# EAGLE design v7-flex2811 (EAGLE 6.5.0)

## Sheet 1 of 16
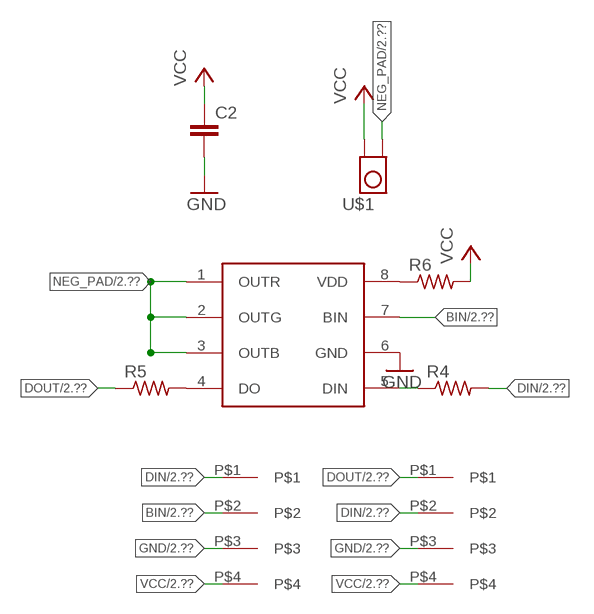
[diagram p0: schematic, sheet 1]

### Parts
C2  C-EUC0201  [C0201]
R4  R-US_R0201  [R0201]
R5  R-US_R0201  [R0201]
R6  R-US_R0201  [R0201]
U$1  TP_4MM_MED_PAD  [TP_4MM_MED_PAD]
U$2  WS2818  [SO08]
U$3  4PAD  [4PAD]
U$4  4PAD  [4PAD]

### Nets
BIN: U$2.7(BIN) U$3.P$2 ; also sheet 2,3,4,5,6,7,8,9,10,11,12,13,14,15,16
DIN: R4.2 U$3.P$1 U$4.P$2 ; also sheet 2,3,4,5,6,7,8,9,10,11,12,13,14,15,16
DOUT: R5.1 U$4.P$1 ; also sheet 2,3,4,5,6,7,8,9,10,11,12,13,14,15,16
GND: C2.2 U$2.6(GND) U$3.P$3 U$4.P$3 ; also sheet 2,3,4,5,6,7,8,9,10,11,12,13,14,15,16
N$4: R4.1 U$2.5(DIN)
N$5: R5.2 U$2.4(DO)
N$6: R6.1 U$2.8(VDD)
NEG_PAD: U$1.P$1 U$2.1(OUTR) U$2.2(OUTG) U$2.3(OUTB) ; also sheet 2,3,4,5,6,7,8,9,10,11,12,13,14,15,16
VCC: C2.1 R6.2 U$1.P$2 U$3.P$4 U$4.P$4 ; also sheet 2,3,4,5,6,7,8,9,10,11,12,13,14,15,16

## Sheet 2 of 16
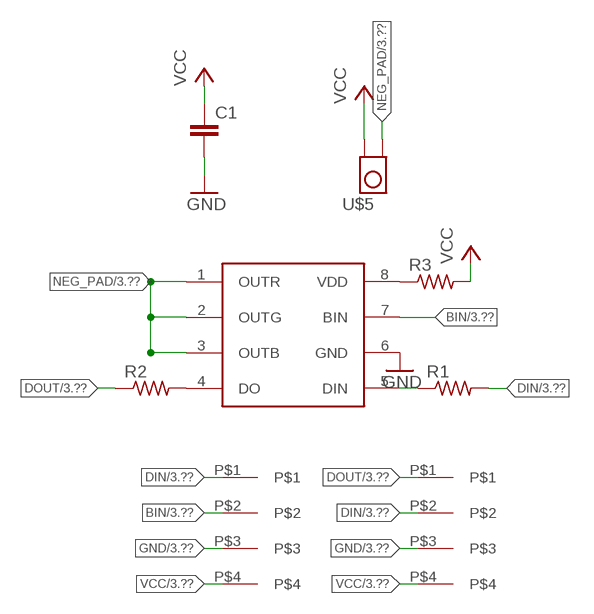
[diagram p1: schematic, sheet 2]

### Parts
C1  C-EUC0201  [C0201]
R1  R-US_R0201  [R0201]
R2  R-US_R0201  [R0201]
R3  R-US_R0201  [R0201]
U$5  TP_4MM_MED_PAD  [TP_4MM_MED_PAD]
U$6  WS2818  [SO08]
U$7  4PAD  [4PAD]
U$8  4PAD  [4PAD]

### Nets
BIN: U$6.7(BIN) U$7.P$2 ; also sheet 1,3,4,5,6,7,8,9,10,11,12,13,14,15,16
DIN: R1.2 U$7.P$1 U$8.P$2 ; also sheet 1,3,4,5,6,7,8,9,10,11,12,13,14,15,16
DOUT: R2.1 U$8.P$1 ; also sheet 1,3,4,5,6,7,8,9,10,11,12,13,14,15,16
GND: C1.2 U$6.6(GND) U$7.P$3 U$8.P$3 ; also sheet 1,3,4,5,6,7,8,9,10,11,12,13,14,15,16
N$1: R1.1 U$6.5(DIN)
N$2: R2.2 U$6.4(DO)
N$3: R3.1 U$6.8(VDD)
NEG_PAD: U$5.P$1 U$6.1(OUTR) U$6.2(OUTG) U$6.3(OUTB) ; also sheet 1,3,4,5,6,7,8,9,10,11,12,13,14,15,16
VCC: C1.1 R3.2 U$5.P$2 U$7.P$4 U$8.P$4 ; also sheet 1,3,4,5,6,7,8,9,10,11,12,13,14,15,16

## Sheet 3 of 16
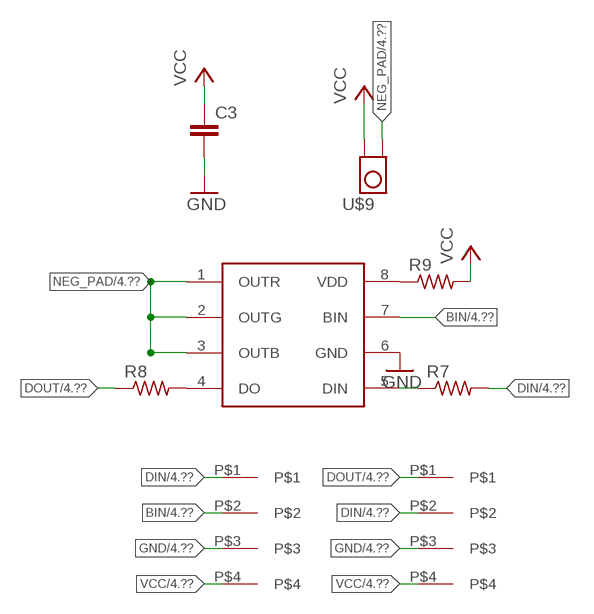
[diagram p2: schematic, sheet 3]

### Parts
C3  C-EUC0201  [C0201]
R7  R-US_R0201  [R0201]
R8  R-US_R0201  [R0201]
R9  R-US_R0201  [R0201]
U$9  TP_4MM_MED_PAD  [TP_4MM_MED_PAD]
U$10  WS2818  [SO08]
U$11  4PAD  [4PAD]
U$12  4PAD  [4PAD]

### Nets
BIN: U$10.7(BIN) U$11.P$2 ; also sheet 1,2,4,5,6,7,8,9,10,11,12,13,14,15,16
DIN: R7.2 U$11.P$1 U$12.P$2 ; also sheet 1,2,4,5,6,7,8,9,10,11,12,13,14,15,16
DOUT: R8.1 U$12.P$1 ; also sheet 1,2,4,5,6,7,8,9,10,11,12,13,14,15,16
GND: C3.2 U$10.6(GND) U$11.P$3 U$12.P$3 ; also sheet 1,2,4,5,6,7,8,9,10,11,12,13,14,15,16
N$7: R7.1 U$10.5(DIN)
N$8: R8.2 U$10.4(DO)
N$9: R9.1 U$10.8(VDD)
NEG_PAD: U$9.P$1 U$10.1(OUTR) U$10.2(OUTG) U$10.3(OUTB) ; also sheet 1,2,4,5,6,7,8,9,10,11,12,13,14,15,16
VCC: C3.1 R9.2 U$9.P$2 U$11.P$4 U$12.P$4 ; also sheet 1,2,4,5,6,7,8,9,10,11,12,13,14,15,16

## Sheet 4 of 16
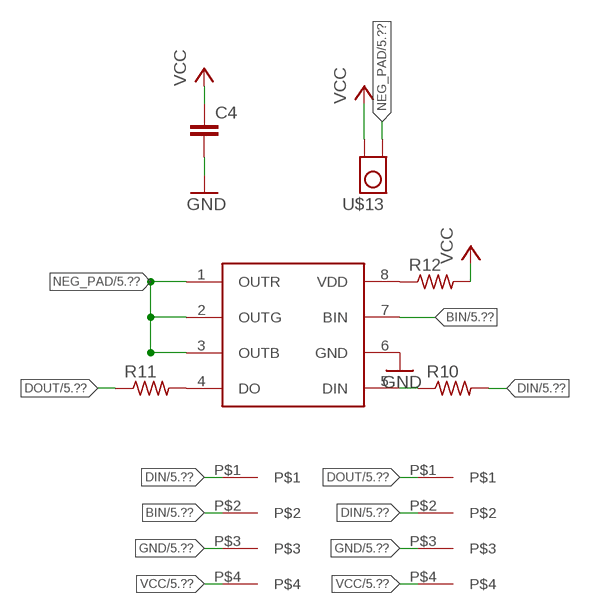
[diagram p3: schematic, sheet 4]

### Parts
C4  C-EUC0201  [C0201]
R10  R-US_R0201  [R0201]
R11  R-US_R0201  [R0201]
R12  R-US_R0201  [R0201]
U$13  TP_4MM_MED_PAD  [TP_4MM_MED_PAD]
U$14  WS2818  [SO08]
U$15  4PAD  [4PAD]
U$16  4PAD  [4PAD]

### Nets
BIN: U$14.7(BIN) U$15.P$2 ; also sheet 1,2,3,5,6,7,8,9,10,11,12,13,14,15,16
DIN: R10.2 U$15.P$1 U$16.P$2 ; also sheet 1,2,3,5,6,7,8,9,10,11,12,13,14,15,16
DOUT: R11.1 U$16.P$1 ; also sheet 1,2,3,5,6,7,8,9,10,11,12,13,14,15,16
GND: C4.2 U$14.6(GND) U$15.P$3 U$16.P$3 ; also sheet 1,2,3,5,6,7,8,9,10,11,12,13,14,15,16
N$10: R10.1 U$14.5(DIN)
N$11: R11.2 U$14.4(DO)
N$12: R12.1 U$14.8(VDD)
NEG_PAD: U$13.P$1 U$14.1(OUTR) U$14.2(OUTG) U$14.3(OUTB) ; also sheet 1,2,3,5,6,7,8,9,10,11,12,13,14,15,16
VCC: C4.1 R12.2 U$13.P$2 U$15.P$4 U$16.P$4 ; also sheet 1,2,3,5,6,7,8,9,10,11,12,13,14,15,16

## Sheet 5 of 16
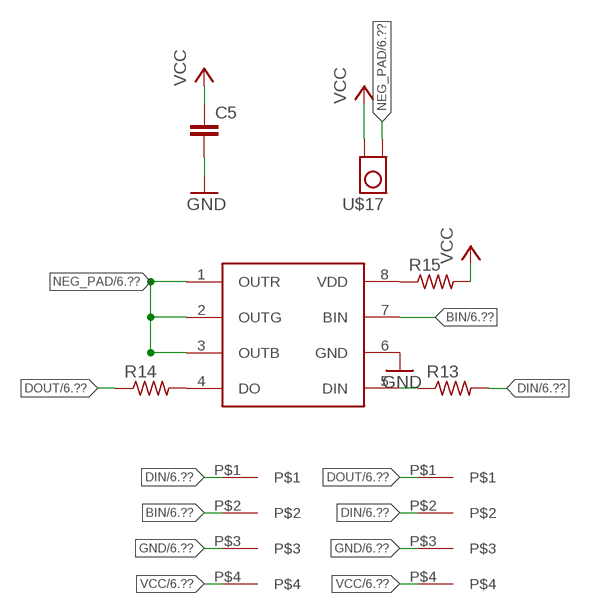
[diagram p4: schematic, sheet 5]

### Parts
C5  C-EUC0201  [C0201]
R13  R-US_R0201  [R0201]
R14  R-US_R0201  [R0201]
R15  R-US_R0201  [R0201]
U$17  TP_4MM_MED_PAD  [TP_4MM_MED_PAD]
U$18  WS2818  [SO08]
U$19  4PAD  [4PAD]
U$20  4PAD  [4PAD]

### Nets
BIN: U$18.7(BIN) U$19.P$2 ; also sheet 1,2,3,4,6,7,8,9,10,11,12,13,14,15,16
DIN: R13.2 U$19.P$1 U$20.P$2 ; also sheet 1,2,3,4,6,7,8,9,10,11,12,13,14,15,16
DOUT: R14.1 U$20.P$1 ; also sheet 1,2,3,4,6,7,8,9,10,11,12,13,14,15,16
GND: C5.2 U$18.6(GND) U$19.P$3 U$20.P$3 ; also sheet 1,2,3,4,6,7,8,9,10,11,12,13,14,15,16
N$13: R13.1 U$18.5(DIN)
N$14: R14.2 U$18.4(DO)
N$15: R15.1 U$18.8(VDD)
NEG_PAD: U$17.P$1 U$18.1(OUTR) U$18.2(OUTG) U$18.3(OUTB) ; also sheet 1,2,3,4,6,7,8,9,10,11,12,13,14,15,16
VCC: C5.1 R15.2 U$17.P$2 U$19.P$4 U$20.P$4 ; also sheet 1,2,3,4,6,7,8,9,10,11,12,13,14,15,16

## Sheet 6 of 16
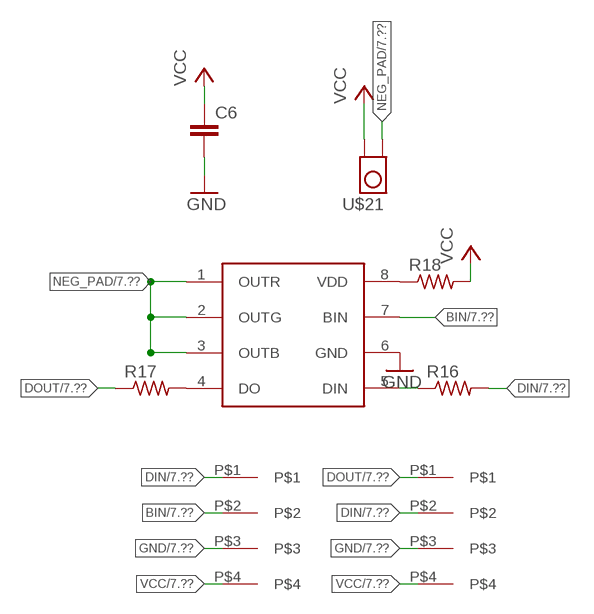
[diagram p5: schematic, sheet 6]

### Parts
C6  C-EUC0201  [C0201]
R16  R-US_R0201  [R0201]
R17  R-US_R0201  [R0201]
R18  R-US_R0201  [R0201]
U$21  TP_4MM_MED_PAD  [TP_4MM_MED_PAD]
U$22  WS2818  [SO08]
U$23  4PAD  [4PAD]
U$24  4PAD  [4PAD]

### Nets
BIN: U$22.7(BIN) U$23.P$2 ; also sheet 1,2,3,4,5,7,8,9,10,11,12,13,14,15,16
DIN: R16.2 U$23.P$1 U$24.P$2 ; also sheet 1,2,3,4,5,7,8,9,10,11,12,13,14,15,16
DOUT: R17.1 U$24.P$1 ; also sheet 1,2,3,4,5,7,8,9,10,11,12,13,14,15,16
GND: C6.2 U$22.6(GND) U$23.P$3 U$24.P$3 ; also sheet 1,2,3,4,5,7,8,9,10,11,12,13,14,15,16
N$16: R16.1 U$22.5(DIN)
N$17: R17.2 U$22.4(DO)
N$18: R18.1 U$22.8(VDD)
NEG_PAD: U$21.P$1 U$22.1(OUTR) U$22.2(OUTG) U$22.3(OUTB) ; also sheet 1,2,3,4,5,7,8,9,10,11,12,13,14,15,16
VCC: C6.1 R18.2 U$21.P$2 U$23.P$4 U$24.P$4 ; also sheet 1,2,3,4,5,7,8,9,10,11,12,13,14,15,16

## Sheet 7 of 16
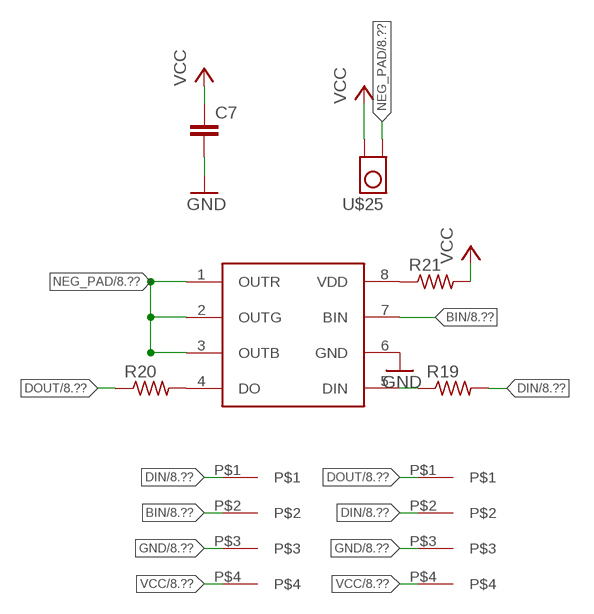
[diagram p6: schematic, sheet 7]

### Parts
C7  C-EUC0201  [C0201]
R19  R-US_R0201  [R0201]
R20  R-US_R0201  [R0201]
R21  R-US_R0201  [R0201]
U$25  TP_4MM_MED_PAD  [TP_4MM_MED_PAD]
U$26  WS2818  [SO08]
U$27  4PAD  [4PAD]
U$28  4PAD  [4PAD]

### Nets
BIN: U$26.7(BIN) U$27.P$2 ; also sheet 1,2,3,4,5,6,8,9,10,11,12,13,14,15,16
DIN: R19.2 U$27.P$1 U$28.P$2 ; also sheet 1,2,3,4,5,6,8,9,10,11,12,13,14,15,16
DOUT: R20.1 U$28.P$1 ; also sheet 1,2,3,4,5,6,8,9,10,11,12,13,14,15,16
GND: C7.2 U$26.6(GND) U$27.P$3 U$28.P$3 ; also sheet 1,2,3,4,5,6,8,9,10,11,12,13,14,15,16
N$19: R19.1 U$26.5(DIN)
N$20: R20.2 U$26.4(DO)
N$21: R21.1 U$26.8(VDD)
NEG_PAD: U$25.P$1 U$26.1(OUTR) U$26.2(OUTG) U$26.3(OUTB) ; also sheet 1,2,3,4,5,6,8,9,10,11,12,13,14,15,16
VCC: C7.1 R21.2 U$25.P$2 U$27.P$4 U$28.P$4 ; also sheet 1,2,3,4,5,6,8,9,10,11,12,13,14,15,16

## Sheet 8 of 16
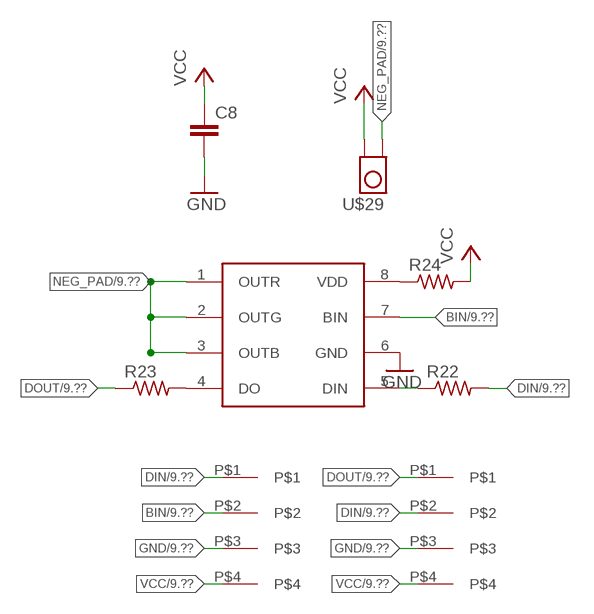
[diagram p7: schematic, sheet 8]

### Parts
C8  C-EUC0201  [C0201]
R22  R-US_R0201  [R0201]
R23  R-US_R0201  [R0201]
R24  R-US_R0201  [R0201]
U$29  TP_4MM_MED_PAD  [TP_4MM_MED_PAD]
U$30  WS2818  [SO08]
U$31  4PAD  [4PAD]
U$32  4PAD  [4PAD]

### Nets
BIN: U$30.7(BIN) U$31.P$2 ; also sheet 1,2,3,4,5,6,7,9,10,11,12,13,14,15,16
DIN: R22.2 U$31.P$1 U$32.P$2 ; also sheet 1,2,3,4,5,6,7,9,10,11,12,13,14,15,16
DOUT: R23.1 U$32.P$1 ; also sheet 1,2,3,4,5,6,7,9,10,11,12,13,14,15,16
GND: C8.2 U$30.6(GND) U$31.P$3 U$32.P$3 ; also sheet 1,2,3,4,5,6,7,9,10,11,12,13,14,15,16
N$22: R22.1 U$30.5(DIN)
N$23: R23.2 U$30.4(DO)
N$24: R24.1 U$30.8(VDD)
NEG_PAD: U$29.P$1 U$30.1(OUTR) U$30.2(OUTG) U$30.3(OUTB) ; also sheet 1,2,3,4,5,6,7,9,10,11,12,13,14,15,16
VCC: C8.1 R24.2 U$29.P$2 U$31.P$4 U$32.P$4 ; also sheet 1,2,3,4,5,6,7,9,10,11,12,13,14,15,16

## Sheet 9 of 16
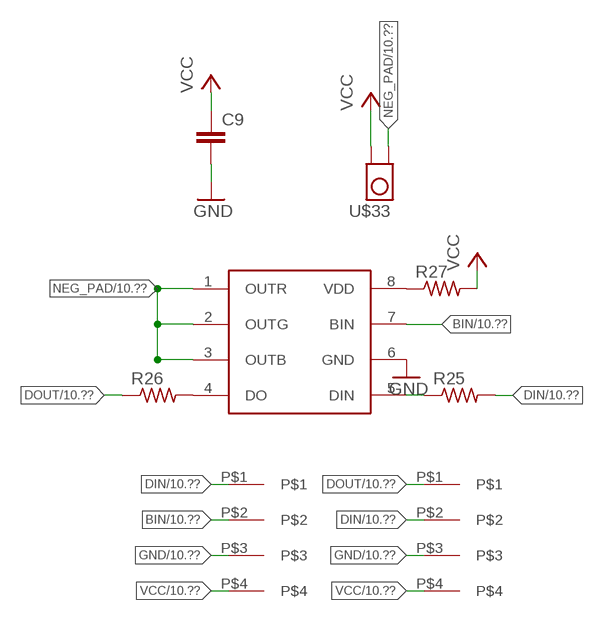
[diagram p8: schematic, sheet 9]

### Parts
C9  C-EUC0201  [C0201]
R25  R-US_R0201  [R0201]
R26  R-US_R0201  [R0201]
R27  R-US_R0201  [R0201]
U$33  TP_4MM_MED_PAD  [TP_4MM_MED_PAD]
U$34  WS2818  [SO08]
U$35  4PAD  [4PAD]
U$36  4PAD  [4PAD]

### Nets
BIN: U$34.7(BIN) U$35.P$2 ; also sheet 1,2,3,4,5,6,7,8,10,11,12,13,14,15,16
DIN: R25.2 U$35.P$1 U$36.P$2 ; also sheet 1,2,3,4,5,6,7,8,10,11,12,13,14,15,16
DOUT: R26.1 U$36.P$1 ; also sheet 1,2,3,4,5,6,7,8,10,11,12,13,14,15,16
GND: C9.2 U$34.6(GND) U$35.P$3 U$36.P$3 ; also sheet 1,2,3,4,5,6,7,8,10,11,12,13,14,15,16
N$25: R25.1 U$34.5(DIN)
N$26: R26.2 U$34.4(DO)
N$27: R27.1 U$34.8(VDD)
NEG_PAD: U$33.P$1 U$34.1(OUTR) U$34.2(OUTG) U$34.3(OUTB) ; also sheet 1,2,3,4,5,6,7,8,10,11,12,13,14,15,16
VCC: C9.1 R27.2 U$33.P$2 U$35.P$4 U$36.P$4 ; also sheet 1,2,3,4,5,6,7,8,10,11,12,13,14,15,16

## Sheet 10 of 16
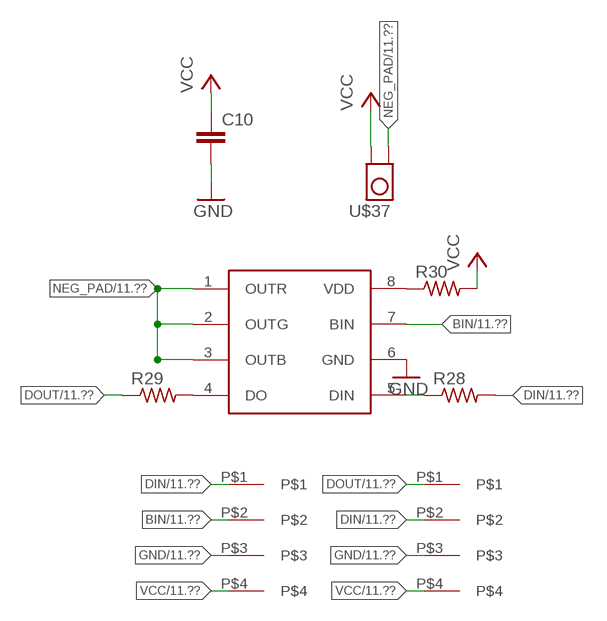
[diagram p9: schematic, sheet 10]

### Parts
C10  C-EUC0201  [C0201]
R28  R-US_R0201  [R0201]
R29  R-US_R0201  [R0201]
R30  R-US_R0201  [R0201]
U$37  TP_4MM_MED_PAD  [TP_4MM_MED_PAD]
U$38  WS2818  [SO08]
U$39  4PAD  [4PAD]
U$40  4PAD  [4PAD]

### Nets
BIN: U$38.7(BIN) U$39.P$2 ; also sheet 1,2,3,4,5,6,7,8,9,11,12,13,14,15,16
DIN: R28.2 U$39.P$1 U$40.P$2 ; also sheet 1,2,3,4,5,6,7,8,9,11,12,13,14,15,16
DOUT: R29.1 U$40.P$1 ; also sheet 1,2,3,4,5,6,7,8,9,11,12,13,14,15,16
GND: C10.2 U$38.6(GND) U$39.P$3 U$40.P$3 ; also sheet 1,2,3,4,5,6,7,8,9,11,12,13,14,15,16
N$28: R28.1 U$38.5(DIN)
N$29: R29.2 U$38.4(DO)
N$30: R30.1 U$38.8(VDD)
NEG_PAD: U$37.P$1 U$38.1(OUTR) U$38.2(OUTG) U$38.3(OUTB) ; also sheet 1,2,3,4,5,6,7,8,9,11,12,13,14,15,16
VCC: C10.1 R30.2 U$37.P$2 U$39.P$4 U$40.P$4 ; also sheet 1,2,3,4,5,6,7,8,9,11,12,13,14,15,16

## Sheet 11 of 16
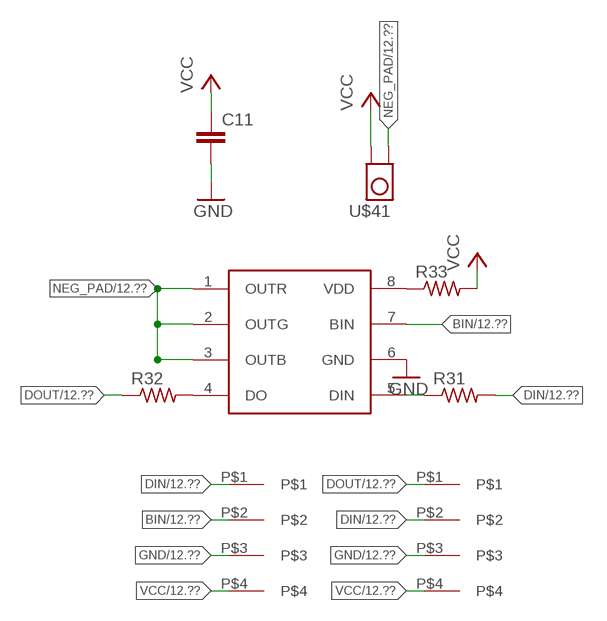
[diagram p10: schematic, sheet 11]

### Parts
C11  C-EUC0201  [C0201]
R31  R-US_R0201  [R0201]
R32  R-US_R0201  [R0201]
R33  R-US_R0201  [R0201]
U$41  TP_4MM_MED_PAD  [TP_4MM_MED_PAD]
U$42  WS2818  [SO08]
U$43  4PAD  [4PAD]
U$44  4PAD  [4PAD]

### Nets
BIN: U$42.7(BIN) U$43.P$2 ; also sheet 1,2,3,4,5,6,7,8,9,10,12,13,14,15,16
DIN: R31.2 U$43.P$1 U$44.P$2 ; also sheet 1,2,3,4,5,6,7,8,9,10,12,13,14,15,16
DOUT: R32.1 U$44.P$1 ; also sheet 1,2,3,4,5,6,7,8,9,10,12,13,14,15,16
GND: C11.2 U$42.6(GND) U$43.P$3 U$44.P$3 ; also sheet 1,2,3,4,5,6,7,8,9,10,12,13,14,15,16
N$31: R31.1 U$42.5(DIN)
N$32: R32.2 U$42.4(DO)
N$33: R33.1 U$42.8(VDD)
NEG_PAD: U$41.P$1 U$42.1(OUTR) U$42.2(OUTG) U$42.3(OUTB) ; also sheet 1,2,3,4,5,6,7,8,9,10,12,13,14,15,16
VCC: C11.1 R33.2 U$41.P$2 U$43.P$4 U$44.P$4 ; also sheet 1,2,3,4,5,6,7,8,9,10,12,13,14,15,16

## Sheet 12 of 16
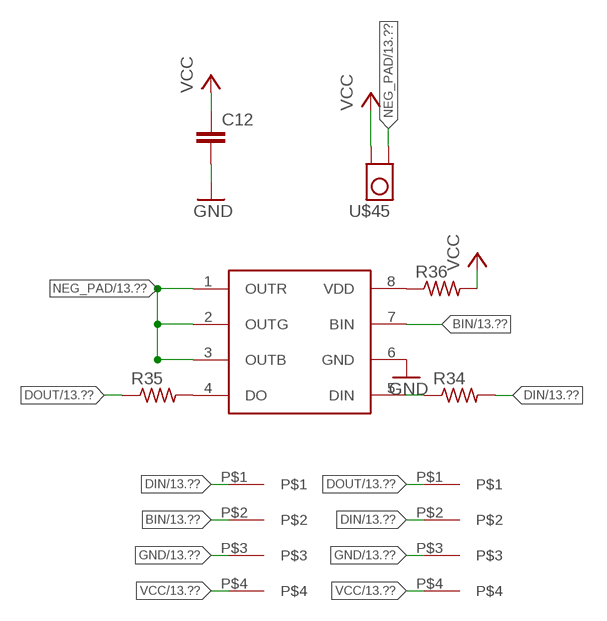
[diagram p11: schematic, sheet 12]

### Parts
C12  C-EUC0201  [C0201]
R34  R-US_R0201  [R0201]
R35  R-US_R0201  [R0201]
R36  R-US_R0201  [R0201]
U$45  TP_4MM_MED_PAD  [TP_4MM_MED_PAD]
U$46  WS2818  [SO08]
U$47  4PAD  [4PAD]
U$48  4PAD  [4PAD]

### Nets
BIN: U$46.7(BIN) U$47.P$2 ; also sheet 1,2,3,4,5,6,7,8,9,10,11,13,14,15,16
DIN: R34.2 U$47.P$1 U$48.P$2 ; also sheet 1,2,3,4,5,6,7,8,9,10,11,13,14,15,16
DOUT: R35.1 U$48.P$1 ; also sheet 1,2,3,4,5,6,7,8,9,10,11,13,14,15,16
GND: C12.2 U$46.6(GND) U$47.P$3 U$48.P$3 ; also sheet 1,2,3,4,5,6,7,8,9,10,11,13,14,15,16
N$34: R34.1 U$46.5(DIN)
N$35: R35.2 U$46.4(DO)
N$36: R36.1 U$46.8(VDD)
NEG_PAD: U$45.P$1 U$46.1(OUTR) U$46.2(OUTG) U$46.3(OUTB) ; also sheet 1,2,3,4,5,6,7,8,9,10,11,13,14,15,16
VCC: C12.1 R36.2 U$45.P$2 U$47.P$4 U$48.P$4 ; also sheet 1,2,3,4,5,6,7,8,9,10,11,13,14,15,16

## Sheet 13 of 16
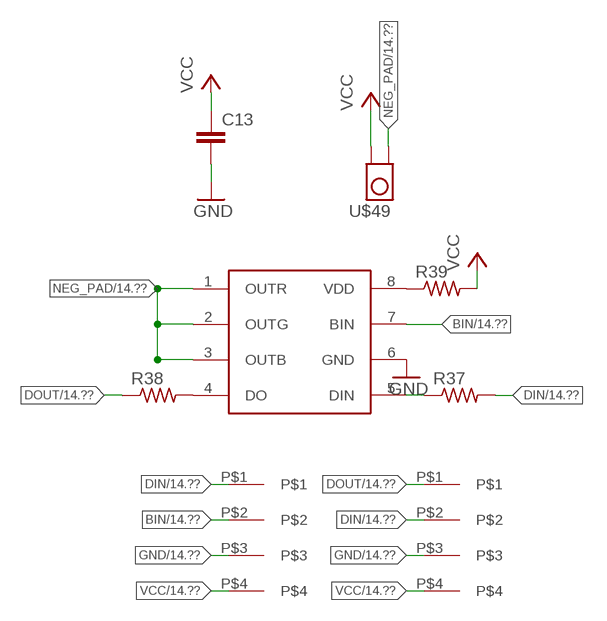
[diagram p12: schematic, sheet 13]

### Parts
C13  C-EUC0201  [C0201]
R37  R-US_R0201  [R0201]
R38  R-US_R0201  [R0201]
R39  R-US_R0201  [R0201]
U$49  TP_4MM_MED_PAD  [TP_4MM_MED_PAD]
U$50  WS2818  [SO08]
U$51  4PAD  [4PAD]
U$52  4PAD  [4PAD]

### Nets
BIN: U$50.7(BIN) U$51.P$2 ; also sheet 1,2,3,4,5,6,7,8,9,10,11,12,14,15,16
DIN: R37.2 U$51.P$1 U$52.P$2 ; also sheet 1,2,3,4,5,6,7,8,9,10,11,12,14,15,16
DOUT: R38.1 U$52.P$1 ; also sheet 1,2,3,4,5,6,7,8,9,10,11,12,14,15,16
GND: C13.2 U$50.6(GND) U$51.P$3 U$52.P$3 ; also sheet 1,2,3,4,5,6,7,8,9,10,11,12,14,15,16
N$37: R37.1 U$50.5(DIN)
N$38: R38.2 U$50.4(DO)
N$39: R39.1 U$50.8(VDD)
NEG_PAD: U$49.P$1 U$50.1(OUTR) U$50.2(OUTG) U$50.3(OUTB) ; also sheet 1,2,3,4,5,6,7,8,9,10,11,12,14,15,16
VCC: C13.1 R39.2 U$49.P$2 U$51.P$4 U$52.P$4 ; also sheet 1,2,3,4,5,6,7,8,9,10,11,12,14,15,16

## Sheet 14 of 16
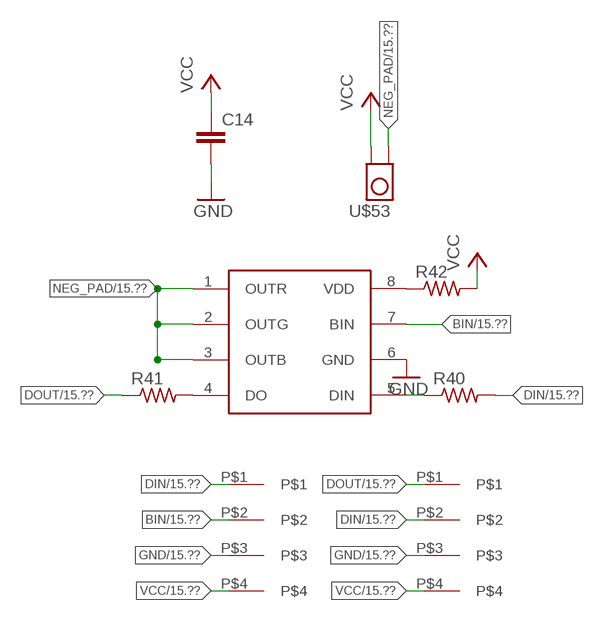
[diagram p13: schematic, sheet 14]

### Parts
C14  C-EUC0201  [C0201]
R40  R-US_R0201  [R0201]
R41  R-US_R0201  [R0201]
R42  R-US_R0201  [R0201]
U$53  TP_4MM_MED_PAD  [TP_4MM_MED_PAD]
U$54  WS2818  [SO08]
U$55  4PAD  [4PAD]
U$56  4PAD  [4PAD]

### Nets
BIN: U$54.7(BIN) U$55.P$2 ; also sheet 1,2,3,4,5,6,7,8,9,10,11,12,13,15,16
DIN: R40.2 U$55.P$1 U$56.P$2 ; also sheet 1,2,3,4,5,6,7,8,9,10,11,12,13,15,16
DOUT: R41.1 U$56.P$1 ; also sheet 1,2,3,4,5,6,7,8,9,10,11,12,13,15,16
GND: C14.2 U$54.6(GND) U$55.P$3 U$56.P$3 ; also sheet 1,2,3,4,5,6,7,8,9,10,11,12,13,15,16
N$40: R40.1 U$54.5(DIN)
N$41: R41.2 U$54.4(DO)
N$42: R42.1 U$54.8(VDD)
NEG_PAD: U$53.P$1 U$54.1(OUTR) U$54.2(OUTG) U$54.3(OUTB) ; also sheet 1,2,3,4,5,6,7,8,9,10,11,12,13,15,16
VCC: C14.1 R42.2 U$53.P$2 U$55.P$4 U$56.P$4 ; also sheet 1,2,3,4,5,6,7,8,9,10,11,12,13,15,16

## Sheet 15 of 16
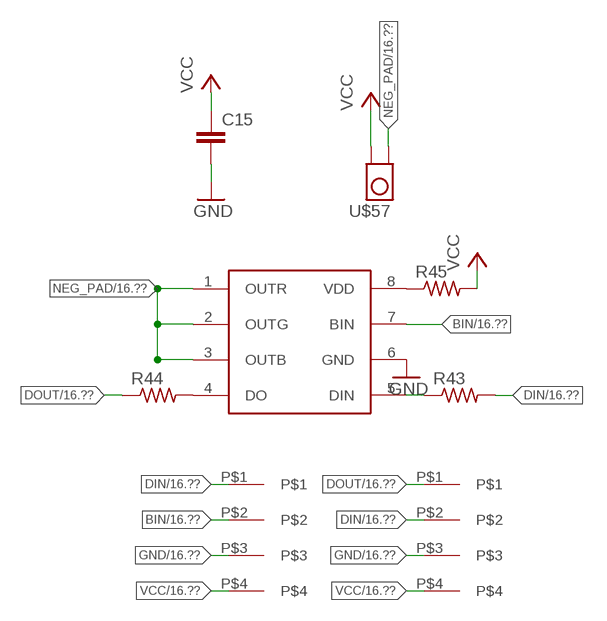
[diagram p14: schematic, sheet 15]

### Parts
C15  C-EUC0201  [C0201]
R43  R-US_R0201  [R0201]
R44  R-US_R0201  [R0201]
R45  R-US_R0201  [R0201]
U$57  TP_4MM_MED_PAD  [TP_4MM_MED_PAD]
U$58  WS2818  [SO08]
U$59  4PAD  [4PAD]
U$60  4PAD  [4PAD]

### Nets
BIN: U$58.7(BIN) U$59.P$2 ; also sheet 1,2,3,4,5,6,7,8,9,10,11,12,13,14,16
DIN: R43.2 U$59.P$1 U$60.P$2 ; also sheet 1,2,3,4,5,6,7,8,9,10,11,12,13,14,16
DOUT: R44.1 U$60.P$1 ; also sheet 1,2,3,4,5,6,7,8,9,10,11,12,13,14,16
GND: C15.2 U$58.6(GND) U$59.P$3 U$60.P$3 ; also sheet 1,2,3,4,5,6,7,8,9,10,11,12,13,14,16
N$43: R43.1 U$58.5(DIN)
N$44: R44.2 U$58.4(DO)
N$45: R45.1 U$58.8(VDD)
NEG_PAD: U$57.P$1 U$58.1(OUTR) U$58.2(OUTG) U$58.3(OUTB) ; also sheet 1,2,3,4,5,6,7,8,9,10,11,12,13,14,16
VCC: C15.1 R45.2 U$57.P$2 U$59.P$4 U$60.P$4 ; also sheet 1,2,3,4,5,6,7,8,9,10,11,12,13,14,16

## Sheet 16 of 16
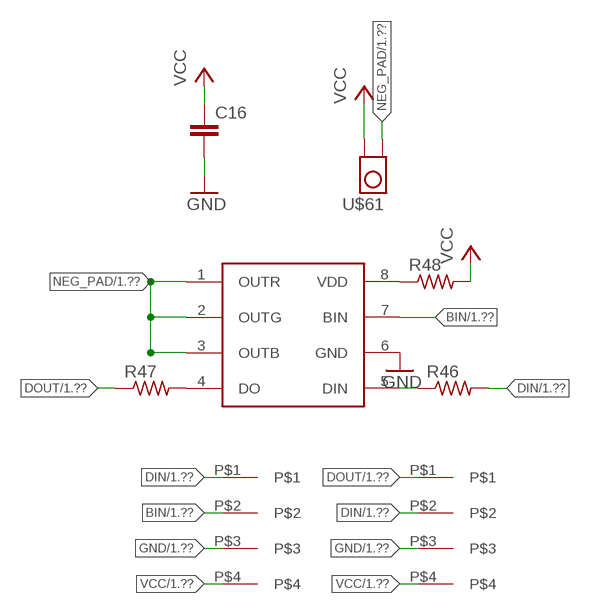
[diagram p15: schematic, sheet 16]

### Parts
C16  C-EUC0201  [C0201]
R46  R-US_R0201  [R0201]
R47  R-US_R0201  [R0201]
R48  R-US_R0201  [R0201]
U$61  TP_4MM_MED_PAD  [TP_4MM_MED_PAD]
U$62  WS2818  [SO08]
U$63  4PAD  [4PAD]
U$64  4PAD  [4PAD]

### Nets
BIN: U$62.7(BIN) U$63.P$2 ; also sheet 1,2,3,4,5,6,7,8,9,10,11,12,13,14,15
DIN: R46.2 U$63.P$1 U$64.P$2 ; also sheet 1,2,3,4,5,6,7,8,9,10,11,12,13,14,15
DOUT: R47.1 U$64.P$1 ; also sheet 1,2,3,4,5,6,7,8,9,10,11,12,13,14,15
GND: C16.2 U$62.6(GND) U$63.P$3 U$64.P$3 ; also sheet 1,2,3,4,5,6,7,8,9,10,11,12,13,14,15
N$46: R46.1 U$62.5(DIN)
N$47: R47.2 U$62.4(DO)
N$48: R48.1 U$62.8(VDD)
NEG_PAD: U$61.P$1 U$62.1(OUTR) U$62.2(OUTG) U$62.3(OUTB) ; also sheet 1,2,3,4,5,6,7,8,9,10,11,12,13,14,15
VCC: C16.1 R48.2 U$61.P$2 U$63.P$4 U$64.P$4 ; also sheet 1,2,3,4,5,6,7,8,9,10,11,12,13,14,15

## Library data of the parts
C1-C16 = rcl:C-EU: CAPACITOR, European symbol
R1-R48 = rcl:R-US_: RESISTOR, American symbol
U$1 U$5 U$9 U$13 U$17 U$21 U$25 U$29 U$33 U$37 U$41 U$45 U$49 U$53 U$57 U$61 = tom-tappytap-v5-flex:TP_4MM_MED_PAD
U$2 U$6 U$10 U$14 U$18 U$22 U$26 U$30 U$34 U$38 U$42 U$46 U$50 U$54 U$58 U$62 = adafruit:WS2818
U$3 U$4 U$7 U$8 U$11 U$12 U$15 U$16 U$19 U$20 U$23 U$24 U$27 U$28 U$31 U$32 U$35 U$36 U$39 U$40 U$43 U$44 U$47 U$48 U$51 U$52 U$55 U$56 U$59 U$60 U$63 U$64 = Sparky:4PAD

## Board
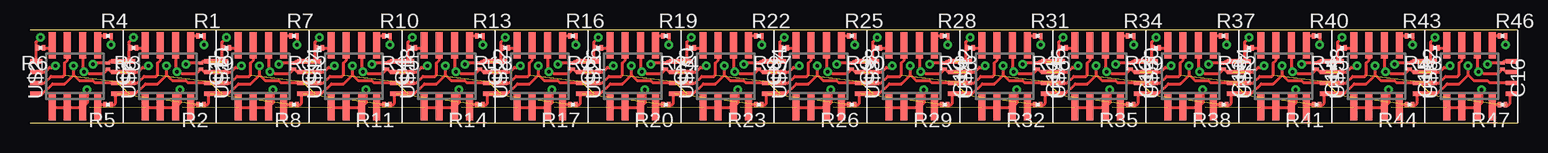
[diagram p16: board, top side]
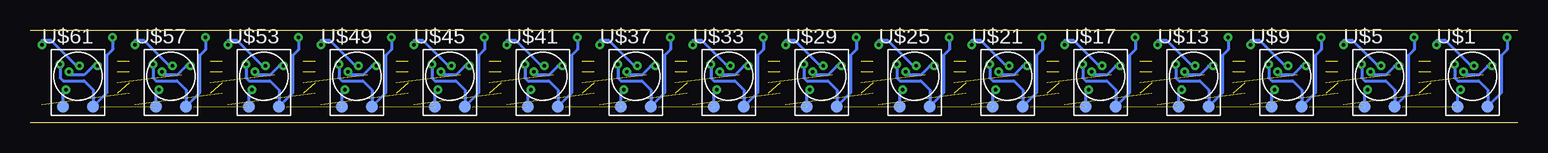
[diagram p17: board, bottom side, seen from below]

Size 124 x 7.75 mm. Coordinates in mm from the lower left corner, seen from the top.
Outline: 0,0 7.75,0 15.5,0 23.25,0 31,0 38.75,0 46.5,0 54.25,0 62,0 69.75,0 77.5,0 85.25,0 93,0 100.75,0 108.5,0 116.25,0 124,0
Outline: 0,7.75 7.75,7.75 15.5,7.75 23.25,7.75 31,7.75 38.75,7.75 46.5,7.75 54.25,7.75 62,7.75 69.75,7.75 77.5,7.75 85.25,7.75 93,7.75 100.75,7.75 108.5,7.75 116.25,7.75 124,7.75
Copper layers (1*16): Top 0.035mm / dielectric 1.5mm / Bottom 0.035mm
Design rules "default *": minimum track width 6mil, minimum drill 3mil, track to track 8mil, track to pad 8mil, pad to pad 8mil, via to via 8mil, smd to smd 8mil, copper to edge 40mil, drill to drill 8mil, minimum pad ring 10mil, minimum via ring 8mil, stop-mask expansion 4mil, vias tented up to drill 0mil, thermal gap 10mil

### Footprints (pad centres in the part's own frame; a part is rotated, then mirrored left to right if it is on the bottom)
C0201 = smd 0.25 x 0.35: 1 -0.25,0; 2 0.25,0
R0201 = smd 0.28 x 0.43: 1 -0.255,0; 2 0.255,0
TP_4MM_MED_PAD = smd 1.016 x 1.016: P$1 -1.24,-2.55; P$2 1.24,-2.55
SO08 = smd 0.6 x 2.2: 1 -1.905,-2.6; 2 -0.635,-2.6; 3 0.635,-2.6; 4 1.905,-2.6; 5 1.905,2.6; 6 0.635,2.6; 7 -0.635,2.6; 8 -1.905,2.6
4PAD = smd 1 x 0.4: P$1 0,0.3 | smd 1 x 0.35: P$2 0,1.2; P$3 0,2.1; P$4 0,3

### Placement (x,y rotation side)
C1  14.25,4.75 270 top
C2  6.5,4.75 270 top
C3  22,4.75 270 top
C4  29.75,4.75 270 top
C5  37.5,4.75 270 top
C6  45.25,4.75 270 top
C7  53,4.75 270 top
C8  60.75,4.75 270 top
C9  68.5,4.75 270 top
C10  76.25,4.75 270 top
C11  84,4.75 270 top
C12  91.75,4.75 270 top
C13  99.5,4.75 270 top
C14  107.25,4.75 270 top
C15  115,4.75 270 top
C16  122.75,4.75 270 top
R1  14.25,7.25 0 top
R2  14.25,1.5 180 top
R3  8.62,6.25 180 top
R4  6.5,7.25 0 top
R5  6.5,1.5 180 top
R6  0.88,6.25 180 top
R7  22,7.25 0 top
R8  22,1.5 180 top
R9  16.38,6.25 180 top
R10  29.75,7.25 0 top
R11  29.75,1.5 180 top
R12  24.12,6.25 180 top
R13  37.5,7.25 0 top
R14  37.5,1.5 180 top
R15  31.88,6.25 180 top
R16  45.25,7.25 0 top
R17  45.25,1.5 180 top
R18  39.62,6.25 180 top
R19  53,7.25 0 top
R20  53,1.5 180 top
R21  47.38,6.25 180 top
R22  60.75,7.25 0 top
R23  60.75,1.5 180 top
R24  55.12,6.25 180 top
R25  68.5,7.25 0 top
R26  68.5,1.5 180 top
R27  62.88,6.25 180 top
R28  76.25,7.25 0 top
R29  76.25,1.5 180 top
R30  70.62,6.25 180 top
R31  84,7.25 0 top
R32  84,1.5 180 top
R33  78.38,6.25 180 top
R34  91.75,7.25 0 top
R35  91.75,1.5 180 top
R36  86.12,6.25 180 top
R37  99.5,7.25 0 top
R38  99.5,1.5 180 top
R39  93.88,6.25 180 top
R40  107.25,7.25 0 top
R41  107.25,1.5 180 top
R42  101.62,6.25 180 top
R43  115,7.25 0 top
R44  115,1.5 180 top
R45  109.38,6.25 180 top
R46  122.75,7.25 0 top
R47  122.75,1.5 180 top
R48  117.12,6.25 180 top
U$1  3.75,3.88 0 bottom
U$2  3.75,3.88 0 top
U$3  0.5,2.12 0 top
U$4  7.25,2.12 0 top
U$5  11.5,3.88 0 bottom
U$6  11.5,3.88 0 top
U$7  8.25,2.12 0 top
U$8  15,2.12 0 top
U$9  19.25,3.88 0 bottom
U$10  19.25,3.88 0 top
U$11  16,2.12 0 top
U$12  22.75,2.12 0 top
U$13  27,3.88 0 bottom
U$14  27,3.88 0 top
U$15  23.75,2.12 0 top
U$16  30.5,2.12 0 top
U$17  34.75,3.88 0 bottom
U$18  34.75,3.88 0 top
U$19  31.5,2.12 0 top
U$20  38.25,2.12 0 top
U$21  42.5,3.88 0 bottom
U$22  42.5,3.88 0 top
U$23  39.25,2.12 0 top
U$24  46,2.12 0 top
U$25  50.25,3.88 0 bottom
U$26  50.25,3.88 0 top
U$27  47,2.12 0 top
U$28  53.75,2.12 0 top
U$29  58,3.88 0 bottom
U$30  58,3.88 0 top
U$31  54.75,2.12 0 top
U$32  61.5,2.12 0 top
U$33  65.75,3.88 0 bottom
U$34  65.75,3.88 0 top
U$35  62.5,2.12 0 top
U$36  69.25,2.12 0 top
U$37  73.5,3.88 0 bottom
U$38  73.5,3.88 0 top
U$39  70.25,2.12 0 top
U$40  77,2.12 0 top
U$41  81.25,3.88 0 bottom
U$42  81.25,3.88 0 top
U$43  78,2.12 0 top
U$44  84.75,2.12 0 top
U$45  89,3.88 0 bottom
U$46  89,3.88 0 top
U$47  85.75,2.12 0 top
U$48  92.5,2.12 0 top
U$49  96.75,3.88 0 bottom
U$50  96.75,3.88 0 top
U$51  93.5,2.12 0 top
U$52  100.25,2.12 0 top
U$53  104.5,3.88 0 bottom
U$54  104.5,3.88 0 top
U$55  101.25,2.12 0 top
U$56  108,2.12 0 top
U$57  112.25,3.88 0 bottom
U$58  112.25,3.88 0 top
U$59  109,2.12 0 top
U$60  115.75,2.12 0 top
U$61  120,3.88 0 bottom
U$62  120,3.88 0 top
U$63  116.75,2.12 0 top
U$64  123.5,2.12 0 top

### Tracks (layer width: path | path; a pad name or v marks a point on that pad's centre or on a via)
BIN  (15 unrouted)
  Top 0.254: U$3.P$2 1.2,3.33 1.75,3.88 2.75,3.88 2.88,4 2.88,5 3.12,5.25 U$2.7 | U$7.P$2 8.95,3.33 9.5,3.88 10.5,3.88 10.62,4 10.62,5 10.88,5.25 U$6.7 | U$11.P$2 16.7,3.33 17.25,3.88 18.25,3.88 18.38,4 18.38,5 18.62,5.25 18.62,6.46 U$10.7 | U$15.P$2 24.45,3.33 25,3.88 26,3.88 26.12,4 26.12,5 26.38,5.25 26.38,6.46 U$14.7 | U$19.P$2 32.2,3.33 32.75,3.88 33.75,3.88 33.88,4 33.88,5 34.12,5.25 U$18.7 | U$23.P$2 39.95,3.33 40.5,3.88 41.5,3.88 41.62,4 41.62,5 41.88,5.25 U$22.7 | U$27.P$2 47.7,3.33 48.25,3.88 49.25,3.88 49.38,4 49.38,5 49.62,5.25 U$26.7 | U$31.P$2 55.45,3.33 56,3.88 57,3.88 57.12,4 57.12,5 57.38,5.25 U$30.7 | U$35.P$2 63.2,3.33 63.75,3.88 64.75,3.88 64.88,4 64.88,5 65.12,5.25 65.12,6.46 U$34.7 | U$39.P$2 70.95,3.33 71.5,3.88 72.5,3.88 72.62,4 72.62,5 72.88,5.25 72.88,6.46 U$38.7 | U$43.P$2 78.7,3.33 79.25,3.88 80.25,3.88 80.38,4 80.38,5 80.62,5.25 80.62,6.46 U$42.7 | U$47.P$2 86.45,3.33 87,3.88 88,3.88 88.12,4 88.12,5 88.38,5.25 88.38,6.46 U$46.7 | U$51.P$2 94.2,3.33 94.75,3.88 95.75,3.88 95.88,4 95.88,5 96.12,5.25 96.12,6.46 U$50.7 | U$55.P$2 101.95,3.33 102.5,3.88 103.5,3.88 103.62,4 103.62,5 103.88,5.25 103.88,6.46 U$54.7 | U$59.P$2 109.7,3.33 110.25,3.88 111.25,3.88 111.38,4 111.38,5 111.62,5.25 111.62,6.46 U$58.7 | U$63.P$2 117.45,3.33 118,3.88 119,3.88 119.12,4 119.12,5 119.38,5.25 119.38,6.46 U$62.7
DIN  (via drill 0.3)  (15 unrouted)
  Top 0.254: U$3.P$1 1.05,2.42 1.88,3.25 2.88,3.25 3.62,4 | 3.62,4 v3.62,4.75 | R4.2 v6.75,6.5 | U$4.P$2 5.42,3.33 5.25,3.5 4.12,3.5 3.62,4 | U$7.P$1 8.8,2.42 9.62,3.25 10.62,3.25 11.38,4 | 11.38,4 v11.38,4.75 | R1.2 v14.51,6.5 v14.5,6.5 | U$8.P$2 13.18,3.33 13,3.5 11.88,3.5 11.38,4 | U$11.P$1 16.55,2.42 17.38,3.25 18.38,3.25 19.12,4 | 19.12,4 v19.12,4.75 | R7.2 v22.25,6.5 | U$12.P$2 20.93,3.33 20.75,3.5 19.62,3.5 19.12,4 | U$15.P$1 24.3,2.42 25.12,3.25 26.12,3.25 26.88,4 | 26.88,4 v26.88,4.75 | R10.2 v30,6.5 | U$16.P$2 28.68,3.33 28.5,3.5 27.38,3.5 26.88,4 | U$19.P$1 32.05,2.42 32.88,3.25 33.88,3.25 34.62,4 | 34.62,4 v34.62,4.75 | R13.2 v37.76,6.5 v37.75,6.5 | U$20.P$2 36.42,3.33 36.25,3.5 35.12,3.5 34.62,4 | U$23.P$1 39.8,2.42 40.62,3.25 41.62,3.25 42.38,4 | 42.38,4 v42.38,4.75 | R16.2 v45.51,6.5 v45.5,6.5 | U$24.P$2 44.17,3.33 44,3.5 42.88,3.5 42.38,4 | U$27.P$1 47.55,2.42 48.38,3.25 49.38,3.25 50.12,4 | 50.12,4 v50.12,4.75 | R19.2 v53.26,6.5 v53.25,6.5 | U$28.P$2 51.92,3.33 51.75,3.5 50.62,3.5 50.12,4 | U$31.P$1 55.3,2.42 56.12,3.25 57.12,3.25 57.88,4 | 57.88,4 v57.88,4.75 | R22.2 v61.01,6.5 v61,6.5 | U$32.P$2 59.67,3.33 59.5,3.5 58.38,3.5 57.88,4 | U$35.P$1 63.05,2.42 63.88,3.25 64.88,3.25 65.62,4 | 65.62,4 v65.62,4.75 | R25.2 v68.75,6.5 | U$36.P$2 67.42,3.33 67.25,3.5 66.12,3.5 65.62,4 | U$39.P$1 70.8,2.42 71.62,3.25 72.62,3.25 73.38,4 | 73.38,4 v73.38,4.75 | R28.2 v76.5,6.5 | U$40.P$2 75.17,3.33 75,3.5 73.88,3.5 73.38,4 | U$43.P$1 78.55,2.42 79.38,3.25 80.38,3.25 81.12,4 | 81.12,4 v81.12,4.75 | R31.2 v84.25,6.5 | U$44.P$2 82.92,3.33 82.75,3.5 81.62,3.5 81.12,4 | U$47.P$1 86.3,2.42 87.12,3.25 88.12,3.25 88.88,4 | 88.88,4 v88.88,4.75
  Top 0.254: R34.2 v92,6.5 | U$48.P$2 90.67,3.33 90.5,3.5 89.38,3.5 88.88,4 | U$51.P$1 94.05,2.42 94.88,3.25 95.88,3.25 96.62,4 | 96.62,4 v96.62,4.75 | R37.2 v99.75,6.5 | U$52.P$2 98.42,3.33 98.25,3.5 97.12,3.5 96.62,4 | U$55.P$1 101.8,2.42 102.62,3.25 103.62,3.25 104.38,4 | 104.38,4 v104.38,4.75 | R40.2 v107.5,6.5 | U$56.P$2 106.17,3.33 106,3.5 104.88,3.5 104.38,4 | U$59.P$1 109.55,2.42 110.38,3.25 111.38,3.25 112.12,4 | 112.12,4 v112.12,4.75 | R43.2 v115.25,6.5 | U$60.P$2 113.92,3.33 113.75,3.5 112.62,3.5 112.12,4 | U$63.P$1 117.3,2.42 118.12,3.25 119.12,3.25 119.88,4 | 119.88,4 v119.88,4.75 | R46.2 v123,6.5 | U$64.P$2 121.67,3.33 121.5,3.5 120.38,3.5 119.88,4
  Bottom 0.254: v3.62,4.75 3.88,4.75 6,6.88 6.75,6.88 v6.75,6.5 | v11.38,4.75 11.62,4.75 13.75,6.88 14.5,6.88 v14.5,6.5 | v19.12,4.75 19.38,4.75 21.5,6.88 22.25,6.88 v22.25,6.5 | v26.88,4.75 27.12,4.75 29.25,6.88 30,6.88 v30,6.5 | v34.62,4.75 34.88,4.75 37,6.88 37.75,6.88 v37.75,6.5 | v42.38,4.75 42.62,4.75 44.75,6.88 45.5,6.88 v45.5,6.5 | v50.12,4.75 50.38,4.75 52.5,6.88 53.25,6.88 v53.25,6.5 | v57.88,4.75 58.12,4.75 60.25,6.88 61,6.88 v61,6.5 | v65.62,4.75 65.88,4.75 68,6.88 68.75,6.88 v68.75,6.5 | v73.38,4.75 73.62,4.75 75.75,6.88 76.5,6.88 v76.5,6.5 | v81.12,4.75 81.38,4.75 83.5,6.88 84.25,6.88 v84.25,6.5 | v88.88,4.75 89.12,4.75 91.25,6.88 92,6.88 v92,6.5 | v96.62,4.75 96.88,4.75 99,6.88 99.75,6.88 v99.75,6.5 | v104.38,4.75 104.62,4.75 106.75,6.88 107.5,6.88 v107.5,6.5 | v112.12,4.75 112.38,4.75 114.5,6.88 115.25,6.88 v115.25,6.5 | v119.88,4.75 120.12,4.75 122.25,6.88 123,6.88 v123,6.5
DOUT  (15 unrouted)
  Top 0.254: R5.1 7,1.5 7.12,1.62 7.12,2.3 U$4.P$1 | R2.1 14.75,1.5 14.88,1.62 14.88,2.3 U$8.P$1 | R8.1 22.5,1.5 22.62,1.62 22.62,2.3 U$12.P$1 | R11.1 30.25,1.5 30.38,1.62 30.38,2.3 U$16.P$1 | R14.1 38,1.5 38.12,1.62 38.12,2.3 U$20.P$1 | R17.1 45.75,1.5 45.88,1.62 45.88,2.3 U$24.P$1 | R20.1 53.5,1.5 53.62,1.62 53.62,2.3 U$28.P$1 | R23.1 61.25,1.5 61.38,1.62 61.38,2.3 U$32.P$1 | R26.1 69,1.5 69.12,1.62 69.12,2.3 U$36.P$1 | R29.1 76.75,1.5 76.88,1.62 76.88,2.3 U$40.P$1 | R32.1 84.5,1.5 84.62,1.62 84.62,2.3 U$44.P$1 | R35.1 92.25,1.5 92.38,1.62 92.38,2.3 U$48.P$1 | R38.1 100,1.5 100.12,1.62 100.12,2.3 U$52.P$1 | R41.1 107.75,1.5 107.88,1.62 107.88,2.3 U$56.P$1 | R44.1 115.5,1.5 115.62,1.62 115.62,2.3 U$60.P$1 | R47.1 123.25,1.5 123.38,1.62 123.38,2.3 U$64.P$1
GND  (via drill 0.3)  (15 unrouted)
  Top 0.254: U$2.6 4.38,4.37 v4.5,4.25 4.75,4.25 4.88,4.12 6.12,4.12 C2.2 6.78,4.22 U$4.P$3 7.22,4.25 | U$3.P$3 0.85,4.22 0.88,4.25 1.25,4.25 1.62,4.62 2,4.62 v2.12,4.75 | U$6.6 12.13,4.37 v12.25,4.25 12.5,4.25 12.62,4.12 13.88,4.12 C1.2 14.53,4.22 U$8.P$3 14.97,4.25 | U$7.P$3 8.6,4.22 8.62,4.25 9,4.25 9.38,4.62 9.75,4.62 v9.88,4.75 | U$10.6 19.89,4.37 v20,4.25 20.25,4.25 20.38,4.12 21.62,4.12 C3.2 22.27,4.22 U$12.P$3 22.73,4.25 | U$11.P$3 16.35,4.22 16.38,4.25 16.75,4.25 17.12,4.62 17.5,4.62 v17.62,4.75 | U$14.6 27.64,4.37 v27.75,4.25 28,4.25 28.12,4.12 29.38,4.12 C4.2 30.02,4.22 U$16.P$3 30.48,4.25 | U$15.P$3 24.1,4.22 24.12,4.25 24.5,4.25 24.88,4.62 25.25,4.62 v25.38,4.75 | U$18.6 35.38,4.37 v35.5,4.25 35.75,4.25 35.88,4.12 37.12,4.12 C5.2 37.77,4.22 U$20.P$3 38.23,4.25 | U$19.P$3 31.85,4.22 31.88,4.25 32.25,4.25 32.62,4.62 33,4.62 v33.12,4.75 | U$22.6 43.13,4.37 v43.25,4.25 43.5,4.25 43.62,4.12 44.88,4.12 C6.2 45.52,4.22 U$24.P$3 45.98,4.25 | U$23.P$3 39.6,4.22 39.62,4.25 40,4.25 40.38,4.62 40.75,4.62 v40.88,4.75 | U$26.6 50.88,4.37 v51,4.25 51.25,4.25 51.38,4.12 52.62,4.12 C7.2 53.27,4.22 U$28.P$3 53.73,4.25 | U$27.P$3 47.35,4.22 47.38,4.25 47.75,4.25 48.12,4.62 48.5,4.62 v48.62,4.75 | U$30.6 58.63,4.37 v58.75,4.25 59,4.25 59.12,4.12 60.38,4.12 C8.2 61.02,4.22 U$32.P$3 61.48,4.25 | U$31.P$3 55.1,4.22 55.12,4.25 55.5,4.25 55.88,4.62 56.25,4.62 v56.38,4.75 | U$34.6 66.39,4.37 v66.5,4.25 66.75,4.25 66.88,4.12 68.12,4.12 C9.2 68.78,4.22 U$36.P$3 69.22,4.25 | U$35.P$3 62.85,4.22 62.88,4.25 63.25,4.25 63.62,4.62 64,4.62 v64.12,4.75 | U$38.6 74.14,4.37 v74.25,4.25 74.5,4.25 74.62,4.12 75.88,4.12 C10.2 76.53,4.22 U$40.P$3 76.97,4.25
  Top 0.254: U$39.P$3 70.6,4.22 70.62,4.25 71,4.25 71.38,4.62 71.75,4.62 v71.88,4.75 | U$42.6 81.89,4.37 v82,4.25 82.25,4.25 82.38,4.12 83.62,4.12 C11.2 84.28,4.22 U$44.P$3 84.72,4.25 | U$43.P$3 78.35,4.22 78.38,4.25 78.75,4.25 79.12,4.62 79.5,4.62 v79.62,4.75 | U$46.6 89.64,4.37 v89.75,4.25 90,4.25 90.12,4.12 91.38,4.12 C12.2 92.03,4.22 U$48.P$3 92.47,4.25 | U$47.P$3 86.1,4.22 86.12,4.25 86.5,4.25 86.88,4.62 87.25,4.62 v87.38,4.75 | U$50.6 97.39,4.37 v97.5,4.25 97.75,4.25 97.88,4.12 99.12,4.12 C13.2 99.78,4.22 U$52.P$3 100.22,4.25 | U$51.P$3 93.85,4.22 93.88,4.25 94.25,4.25 94.62,4.62 95,4.62 v95.12,4.75 | U$54.6 105.14,4.37 v105.25,4.25 105.5,4.25 105.62,4.12 106.88,4.12 C14.2 107.53,4.22 U$56.P$3 107.97,4.25 | U$55.P$3 101.6,4.22 101.62,4.25 102,4.25 102.38,4.62 102.75,4.62 v102.88,4.75 | U$58.6 112.89,4.37 v113,4.25 113.25,4.25 113.38,4.12 114.62,4.12 C15.2 115.28,4.22 U$60.P$3 115.72,4.25 | U$59.P$3 109.35,4.22 109.38,4.25 109.75,4.25 110.12,4.62 110.5,4.62 v110.62,4.75 | U$62.6 120.64,4.37 v120.75,4.25 121,4.25 121.12,4.12 122.38,4.12 C16.2 123.03,4.22 U$64.P$3 123.47,4.25 | U$63.P$3 117.1,4.22 117.12,4.25 117.5,4.25 117.88,4.62 118.25,4.62 v118.38,4.75
  Bottom 0.254: v4.5,4.25 4.5,4 3.25,4 2.5,4.75 v2.12,4.75 | v12.25,4.25 12.25,4 11,4 10.25,4.75 v9.88,4.75 | v20,4.25 20,4 18.75,4 18,4.75 v17.62,4.75 | v27.75,4.25 27.75,4 26.5,4 25.75,4.75 v25.38,4.75 | v35.5,4.25 35.5,4 34.25,4 33.5,4.75 v33.12,4.75 | v43.25,4.25 43.25,4 42,4 41.25,4.75 v40.88,4.75 | v51,4.25 51,4 49.75,4 49,4.75 v48.62,4.75 | v58.75,4.25 58.75,4 57.5,4 56.75,4.75 v56.38,4.75 | v66.5,4.25 66.5,4 65.25,4 64.5,4.75 v64.12,4.75 | v74.25,4.25 74.25,4 73,4 72.25,4.75 v71.88,4.75 | v82,4.25 82,4 80.75,4 80,4.75 v79.62,4.75 | v89.75,4.25 89.75,4 88.5,4 87.75,4.75 v87.38,4.75 | v97.5,4.25 97.5,4 96.25,4 95.5,4.75 v95.12,4.75 | v105.25,4.25 105.25,4 104,4 103.25,4.75 v102.88,4.75 | v113,4.25 113,4 111.75,4 111,4.75 v110.62,4.75 | v120.75,4.25 120.75,4 119.5,4 118.75,4.75 v118.38,4.75
N$1
  Top 0.254: U$6.5 13.38,6.5 13.38,7 13.62,7.25 R1.1
  Top 0.406: 13.4,6.78 U$6.5
N$2
  Top 0.254: R2.2 13.63,1.5 U$6.4
N$3
  Top 0.254: R3.1 9.37,6.25 U$6.8
  Top 0.406: 9.6,6.78 U$6.8
N$4
  Top 0.254: U$2.5 5.62,6.5 5.62,7 5.88,7.25 R4.1
  Top 0.406: 5.66,6.78 U$2.5
N$5
  Top 0.254: R5.2 5.88,1.5 U$2.4
N$6
  Top 0.254: R6.1 1.62,6.25 U$2.8
  Top 0.406: 1.84,6.78 U$2.8
N$7
  Top 0.254: U$10.5 21.12,6.5 21.12,7 21.38,7.25 R7.1
  Top 0.406: 21.16,6.78 U$10.5
N$8
  Top 0.254: R8.2 21.38,1.5 U$10.4
N$9
  Top 0.254: R9.1 17.12,6.25 U$10.8
  Top 0.406: 17.34,6.78 U$10.8
N$10
  Top 0.254: U$14.5 28.88,6.5 28.88,7 29.12,7.25 R10.1
  Top 0.406: 28.91,6.78 U$14.5
N$11
  Top 0.254: R11.2 29.13,1.5 U$14.4
N$12
  Top 0.254: R12.1 24.87,6.25 U$14.8
  Top 0.406: 25.09,6.78 U$14.8
N$13
  Top 0.254: U$18.5 36.62,6.5 36.62,7 36.88,7.25 R13.1
  Top 0.406: 36.66,6.78 U$18.5
N$14
  Top 0.254: R14.2 36.88,1.5 U$18.4
N$15
  Top 0.254: R15.1 32.62,6.25 U$18.8
  Top 0.406: 32.84,6.78 U$18.8
N$16
  Top 0.254: U$22.5 44.38,6.5 44.38,7 44.62,7.25 R16.1
  Top 0.406: 44.41,6.78 U$22.5
N$17
  Top 0.254: R17.2 44.63,1.5 U$22.4
N$18
  Top 0.254: R18.1 40.37,6.25 U$22.8
  Top 0.406: 40.59,6.78 U$22.8
N$19
  Top 0.254: U$26.5 52.12,6.5 52.12,7 52.38,7.25 R19.1
  Top 0.406: 52.16,6.78 U$26.5
N$20
  Top 0.254: R20.2 52.38,1.5 U$26.4
N$21
  Top 0.254: R21.1 48.12,6.25 U$26.8
  Top 0.406: 48.34,6.78 U$26.8
N$22
  Top 0.254: U$30.5 59.88,6.5 59.88,7 60.12,7.25 R22.1
  Top 0.406: 59.91,6.78 U$30.5
N$23
  Top 0.254: R23.2 60.13,1.5 U$30.4
N$24
  Top 0.254: R24.1 55.87,6.25 U$30.8
  Top 0.406: 56.09,6.78 U$30.8
N$25
  Top 0.254: U$34.5 67.62,6.5 67.62,7 67.88,7.25 R25.1
  Top 0.406: 67.66,6.78 U$34.5
N$26
  Top 0.254: R26.2 67.88,1.5 U$34.4
N$27
  Top 0.254: R27.1 63.62,6.25 U$34.8
  Top 0.406: 63.84,6.78 U$34.8
N$28
  Top 0.254: U$38.5 75.38,6.5 75.38,7 75.62,7.25 R28.1
  Top 0.406: 75.41,6.78 U$38.5
N$29
  Top 0.254: R29.2 75.63,1.5 U$38.4
N$30
  Top 0.254: R30.1 71.37,6.25 U$38.8
  Top 0.406: 71.59,6.78 U$38.8
N$31
  Top 0.254: U$42.5 83.12,6.5 83.12,7 83.38,7.25 R31.1
  Top 0.406: 83.16,6.78 U$42.5
N$32
  Top 0.254: R32.2 83.38,1.5 U$42.4
N$33
  Top 0.254: R33.1 79.12,6.25 U$42.8
  Top 0.406: 79.34,6.78 U$42.8
N$34
  Top 0.254: U$46.5 90.88,6.5 90.88,7 91.12,7.25 R34.1
  Top 0.406: 90.91,6.78 U$46.5
N$35
  Top 0.254: R35.2 91.13,1.5 U$46.4
N$36
  Top 0.254: R36.1 86.87,6.25 U$46.8
  Top 0.406: 87.09,6.78 U$46.8
N$37
  Top 0.254: U$50.5 98.62,6.5 98.62,7 98.88,7.25 R37.1
  Top 0.406: 98.66,6.78 U$50.5
N$38
  Top 0.254: R38.2 98.88,1.5 U$50.4
N$39
  Top 0.254: R39.1 94.62,6.25 U$50.8
  Top 0.406: 94.84,6.78 U$50.8
N$40
  Top 0.254: U$54.5 106.38,6.5 106.38,7 106.62,7.25 R40.1
  Top 0.406: 106.41,6.78 U$54.5
N$41
  Top 0.254: R41.2 106.63,1.5 U$54.4
N$42
  Top 0.254: R42.1 102.37,6.25 U$54.8
  Top 0.406: 102.59,6.78 U$54.8
N$43
  Top 0.254: U$58.5 114.12,6.5 114.12,7 114.38,7.25 R43.1
  Top 0.406: 114.16,6.78 U$58.5
N$44
  Top 0.254: R44.2 114.38,1.5 U$58.4
N$45
  Top 0.254: R45.1 110.12,6.25 U$58.8
  Top 0.406: 110.34,6.78 U$58.8
N$46
  Top 0.254: U$62.5 121.88,6.5 121.88,7 122.12,7.25 R46.1
  Top 0.406: 121.91,6.78 U$62.5
N$47
  Top 0.254: R47.2 122.13,1.5 U$62.4
N$48
  Top 0.254: R48.1 117.87,6.25 U$62.8
  Top 0.406: 118.09,6.78 U$62.8
NEG_PAD  (via drill 0.3)  (15 unrouted)
  Top 0.254: U$2.1 U$2.2 U$2.3 4.75,1.64 v4.75,2.75 | U$6.1 U$6.2 U$6.3 12.5,1.64 v12.5,2.75 | U$10.1 U$10.2 U$10.3 20.25,1.64 v20.25,2.75 | U$14.1 U$14.2 U$14.3 28,1.64 v28,2.75 | U$18.1 U$18.2 U$18.3 35.75,1.64 v35.75,2.75 | U$22.1 U$22.2 U$22.3 43.5,1.64 v43.5,2.75 | U$26.1 U$26.2 U$26.3 51.25,1.64 v51.25,2.75 | U$30.1 U$30.2 U$30.3 59,1.64 v59,2.75 | U$34.1 U$34.2 U$34.3 66.75,1.64 v66.75,2.75 | U$38.1 U$38.2 U$38.3 74.5,1.64 v74.5,2.75 | U$42.1 U$42.2 U$42.3 82.25,1.64 v82.25,2.75 | U$46.1 U$46.2 U$46.3 90,1.64 v90,2.75 | U$50.1 U$50.2 U$50.3 97.75,1.64 v97.75,2.75 | U$54.1 U$54.2 U$54.3 105.5,1.64 v105.5,2.75 | U$58.1 U$58.2 U$58.3 113.25,1.64 v113.25,2.75 | U$62.1 U$62.2 U$62.3 121,1.64 v121,2.75
  Bottom 0.254: U$1.P$1 4.99,2.51 v4.75,2.75 | U$5.P$1 12.74,2.51 v12.5,2.75 | U$9.P$1 20.49,2.51 v20.25,2.75 | U$13.P$1 28.24,2.51 v28,2.75 | U$17.P$1 35.99,2.51 v35.75,2.75 | U$21.P$1 43.74,2.51 v43.5,2.75 | U$25.P$1 51.49,2.51 v51.25,2.75 | U$29.P$1 59.24,2.51 v59,2.75 | U$33.P$1 66.99,2.51 v66.75,2.75 | U$37.P$1 74.74,2.51 v74.5,2.75 | U$41.P$1 82.49,2.51 v82.25,2.75 | U$45.P$1 90.24,2.51 v90,2.75 | U$49.P$1 97.99,2.51 v97.75,2.75 | U$53.P$1 105.74,2.51 v105.5,2.75 | U$57.P$1 113.49,2.51 v113.25,2.75 | U$61.P$1 121.24,2.51 v121,2.75
VCC  (via drill 0.3)  (15 unrouted)
  Top 0.254: U$4.P$4 6.62,5.12 C2.1 5.38,5 v5.25,4.88 | R6.2 0.5,6.25 | 0.5,6.25 0.5,6.75 v0.88,7.12 | U$3.P$4 0.5,6.25 | U$8.P$4 14.38,5.12 C1.1 13.12,5 v13,4.88 | R3.2 8.25,6.25 | 8.25,6.25 8.25,6.75 v8.62,7.12 | U$7.P$4 8.25,6.25 | U$12.P$4 22.12,5.12 C3.1 20.88,5 v20.75,4.88 | R9.2 16,6.25 | 16,6.25 16,6.75 v16.38,7.12 | U$11.P$4 16,6.25 | U$16.P$4 29.88,5.12 C4.1 28.62,5 v28.5,4.88 | R12.2 23.75,6.25 | 23.75,6.25 23.75,6.75 v24.12,7.12 | U$15.P$4 23.75,6.25 | U$20.P$4 37.62,5.12 C5.1 36.38,5 v36.25,4.88 | R15.2 31.5,6.25 | 31.5,6.25 31.5,6.75 v31.88,7.12 | U$19.P$4 31.5,6.25 | U$24.P$4 45.38,5.12 C6.1 44.12,5 v44,4.88 | R18.2 39.25,6.25 | 39.25,6.25 39.25,6.75 v39.62,7.12 | U$23.P$4 39.25,6.25 | U$28.P$4 53.12,5.12 C7.1 51.88,5 v51.75,4.88 | R21.2 47,6.25 | 47,6.25 47,6.75 v47.38,7.12 | U$27.P$4 47,6.25 | U$32.P$4 60.88,5.12 C8.1 59.62,5 v59.5,4.88 | R24.2 54.75,6.25 | 54.75,6.25 54.75,6.75 v55.12,7.12 | U$31.P$4 54.75,6.25 | U$36.P$4 68.62,5.12 C9.1 67.38,5 v67.25,4.88 | R27.2 62.5,6.25 | 62.5,6.25 62.5,6.75 v62.88,7.12 | U$35.P$4 62.5,6.25 | U$40.P$4 76.38,5.12 C10.1 75.12,5 v75,4.88 | R30.2 70.25,6.25 | 70.25,6.25 70.25,6.75 v70.62,7.12 | U$39.P$4 70.25,6.25 | U$44.P$4 84.12,5.12 C11.1 82.88,5 v82.75,4.88 | R33.2 78,6.25 | 78,6.25 78,6.75 v78.38,7.12 | U$43.P$4 78,6.25 | U$48.P$4 91.88,5.12 C12.1 90.62,5 v90.5,4.88 | R36.2 85.75,6.25 | 85.75,6.25 85.75,6.75 v86.12,7.12 | U$47.P$4 85.75,6.25 | U$52.P$4 99.62,5.12 C13.1 98.38,5 v98.25,4.88 | R39.2 93.5,6.25 | 93.5,6.25 93.5,6.75 v93.88,7.12 | U$51.P$4 93.5,6.25 | U$56.P$4 107.38,5.12 C14.1 106.12,5 v106,4.88 | R42.2 101.25,6.25 | 101.25,6.25 101.25,6.75 v101.62,7.12 | U$55.P$4 101.25,6.25 | U$60.P$4 115.12,5.12 C15.1 113.88,5 v113.75,4.88
  Top 0.254: R45.2 109,6.25 | 109,6.25 109,6.75 v109.38,7.12 | U$59.P$4 109,6.25 | U$64.P$4 122.88,5.12 C16.1 121.62,5 v121.5,4.88 | R48.2 116.75,6.25 | 116.75,6.25 116.75,6.75 v117.12,7.12 | U$63.P$4 116.75,6.25
  Bottom 0.254: v0.88,7.12 0.88,6.12 1.38,5.62 1.38,2.46 U$1.P$2 2.5,2.75 3.25,3.5 5,3.5 5.25,3.75 v5.25,4.88 | v8.62,7.12 8.62,6.12 9.12,5.62 9.12,2.46 U$5.P$2 10.25,2.75 11,3.5 12.75,3.5 13,3.75 v13,4.88 | v16.38,7.12 16.38,6.12 16.88,5.62 16.88,2.46 U$9.P$2 18,2.75 18.75,3.5 20.5,3.5 20.75,3.75 v20.75,4.88 | v24.12,7.12 24.12,6.12 24.62,5.62 24.62,2.46 U$13.P$2 25.75,2.75 26.5,3.5 28.25,3.5 28.5,3.75 v28.5,4.88 | v31.88,7.12 31.88,6.12 32.38,5.62 32.38,2.46 U$17.P$2 33.5,2.75 34.25,3.5 36,3.5 36.25,3.75 v36.25,4.88 | v39.62,7.12 39.62,6.12 40.12,5.62 40.12,2.46 U$21.P$2 41.25,2.75 42,3.5 43.75,3.5 44,3.75 v44,4.88 | v47.38,7.12 47.38,6.12 47.88,5.62 47.88,2.46 U$25.P$2 49,2.75 49.75,3.5 51.5,3.5 51.75,3.75 v51.75,4.88 | v55.12,7.12 55.12,6.12 55.62,5.62 55.62,2.46 U$29.P$2 56.75,2.75 57.5,3.5 59.25,3.5 59.5,3.75 v59.5,4.88 | v62.88,7.12 62.88,6.12 63.38,5.62 63.38,2.46 U$33.P$2 64.5,2.75 65.25,3.5 67,3.5 67.25,3.75 v67.25,4.88 | v70.62,7.12 70.62,6.12 71.12,5.62 71.12,2.46 U$37.P$2 72.25,2.75 73,3.5 74.75,3.5 75,3.75 v75,4.88 | v78.38,7.12 78.38,6.12 78.88,5.62 78.88,2.46 U$41.P$2 80,2.75 80.75,3.5 82.5,3.5 82.75,3.75 v82.75,4.88 | v86.12,7.12 86.12,6.12 86.62,5.62 86.62,2.46 U$45.P$2 87.75,2.75 88.5,3.5 90.25,3.5 90.5,3.75 v90.5,4.88 | v93.88,7.12 93.88,6.12 94.38,5.62 94.38,2.46 U$49.P$2 95.5,2.75 96.25,3.5 98,3.5 98.25,3.75 v98.25,4.88 | v101.62,7.12 101.62,6.12 102.12,5.62 102.12,2.46 U$53.P$2 103.25,2.75 104,3.5 105.75,3.5 106,3.75 v106,4.88 | v109.38,7.12 109.38,6.12 109.88,5.62 109.88,2.46 U$57.P$2 111,2.75 111.75,3.5 113.5,3.5 113.75,3.75 v113.75,4.88
  Bottom 0.254: v117.12,7.12 117.12,6.12 117.62,5.62 117.62,2.46 U$61.P$2 118.75,2.75 119.5,3.5 121.25,3.5 121.5,3.75 v121.5,4.88